# Altium schematic sheet Power.SchDoc: Power management
size A4; Author: Ph.A; SheetNumber: 6; SheetTotal: 8
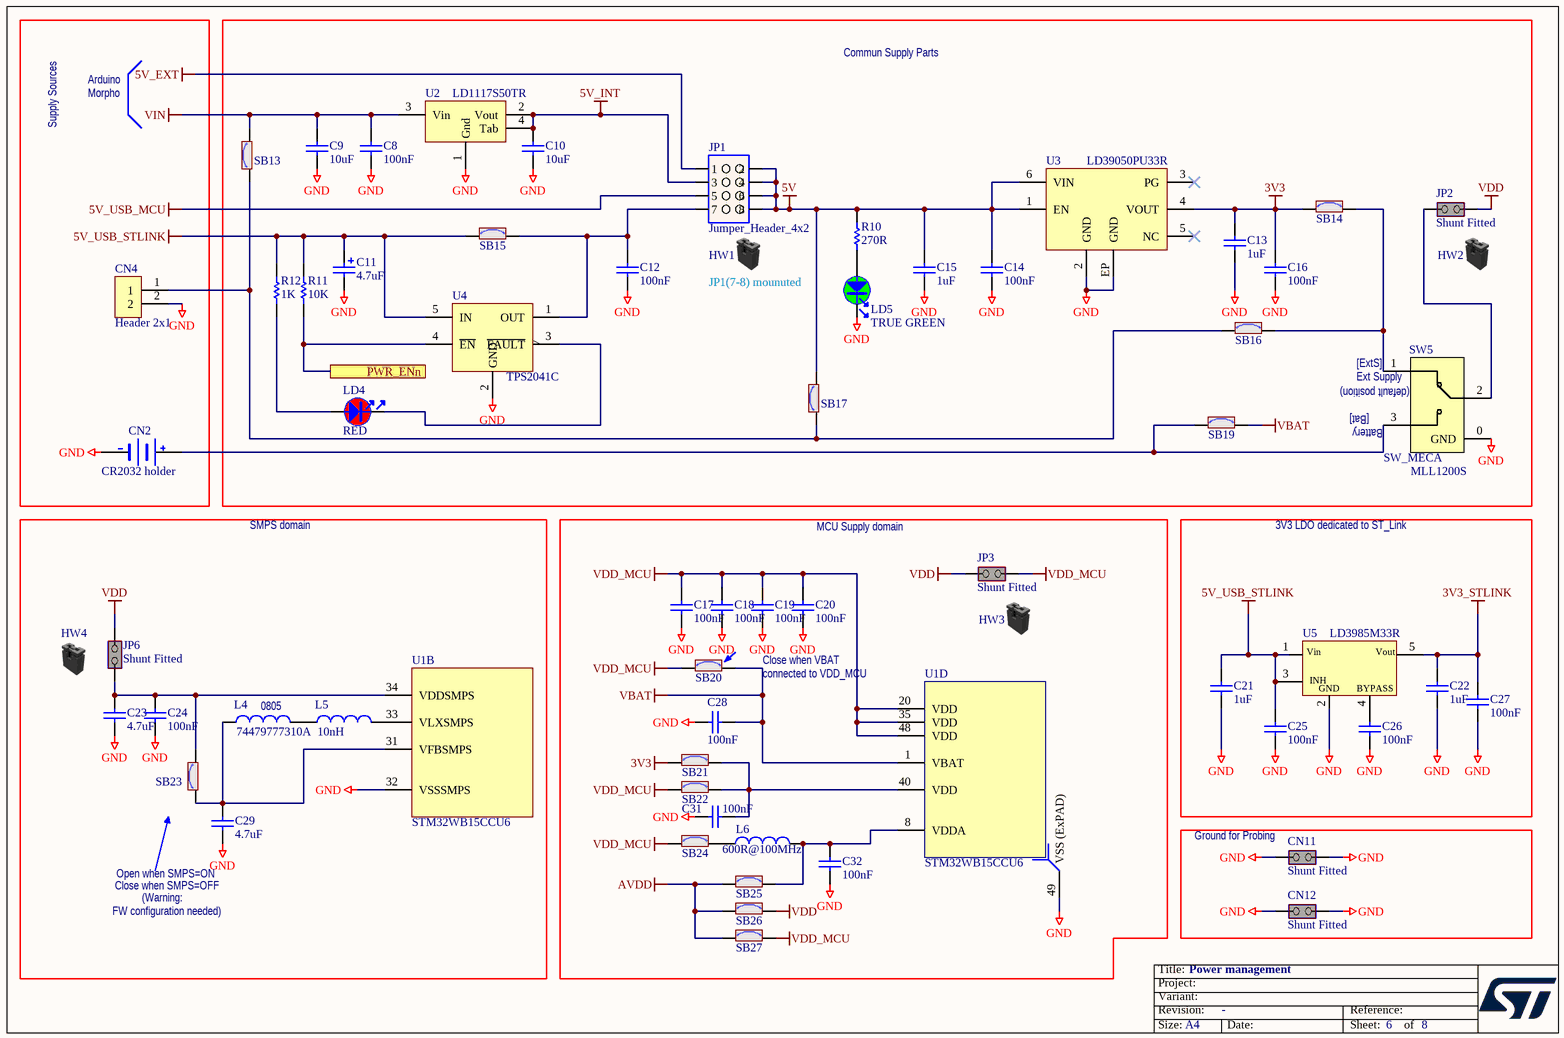
[diagram p0: Power.SchDoc]

## Parts
C8  value 100nF  [C0603]  (hidden comment: Capacitor)
C9  value 10uF  [C0805]  (hidden comment: Capacitor)
C10  value 10uF  [C0805]  (hidden comment: Capacitor)
C11  value 4.7uF  [CPOL_TAJ-A_1206_H180]  (hidden comment: Cap_POL_TANA)
C12  value 100nF  [C0402]  (hidden comment: Capacitor)
C13  value 1uF  [C0603]  (hidden comment: Capacitor)
C14  value 100nF  [C0402]  (hidden comment: Capacitor)
C15  value 1uF  [C0603]  (hidden comment: Capacitor)
C16  value 100nF  [C0402]  (hidden comment: Capacitor)
C17  value 100nF  [C0402]  (hidden comment: Capacitor)
C18  value 100nF  [C0402]  (hidden comment: Capacitor)
C19  value 100nF  [C0402]  (hidden comment: Capacitor)
C20  value 100nF  [C0402]  (hidden comment: Capacitor)
C21  value 1uF  [C0603]  (hidden comment: Capacitor)
C22  value 1uF  [C0603]  (hidden comment: Capacitor)
C23  value 4.7uF  [C0402]  (hidden comment: Capacitor)
C24  value 100nF  [C0402]  (hidden comment: Capacitor)
C25  value 100nF  [C0402]  (hidden comment: Capacitor)
C26  value 100nF  [C0402]  (hidden comment: Capacitor)
C27  value 100nF  [C0402]  (hidden comment: Capacitor)
C28  value 100nF  [C0402]  (hidden comment: Capacitor)
C29  value 4.7uF  [C0402]  (hidden comment: Capacitor)
C31  value 100nF  [C0402]  (hidden comment: Capacitor)
C32  value 100nF  [C0402]  (hidden comment: Capacitor)
CN2  value CR2032 holder  [BAT_RENATA-SMTU2032-LF_KEYSTONE-1769533_CR2032_SMD_2P_DI]  (hidden comment: BATTERY HOLDER)
CN4  Header 2x1  [CON_SAMTEC_TSW-102-07-G-S]
CN11  value Shunt Fitted  [CON_SAMTEC_TSW-102-07-G-S]  (hidden comment: Jumper_Header 2x1 Fitted)
CN12  value Shunt Fitted  [CON_SAMTEC_TSW-102-07-G-S]  (hidden comment: Jumper_Header 2x1 Fitted)
HW1  Shunt Black 2.54mm  (value not drawn)  (mechanical)
HW2  Shunt Black 2.54mm  (value not drawn)  (mechanical)
HW3  Shunt Black 2.54mm  (value not drawn)  (mechanical)
HW4  Shunt Black 2.54mm  (value not drawn)  (mechanical)
JP1  value Jumper_Header_4x2  [CON_SAMTEC_TSW-104-07-X-D]  (hidden comment: Jumper_Header 4x2)
JP2  value Shunt Fitted  [CON_SAMTEC_TSW-102-07-G-S]  (hidden comment: Jumper_Header 2x1 Fitted)
JP3  value Shunt Fitted  [CON_SAMTEC_TSW-102-07-G-S]  (hidden comment: Jumper_Header 2x1 Fitted)
JP6  value Shunt Fitted  [CON_SAMTEC_TSW-102-07-G-S]  (hidden comment: Jumper_Header 2x1 Fitted)
L4  value 74479777310A  [IND_0805_WURTH_74479777310A]  (hidden comment: Inductor)
L5  value 10nH  [IND_0402_MURATA_LQW15AN_H0P5]  (hidden comment: Inductor)
L6  value 600R@100MHz  [L0603]  (hidden comment: BEAD)
LD4  value RED  [LED_0603_VISHAY_VLMS1300-GS08_RED_1A2K_H0P8]  (hidden comment: LED_red)
LD5  value TRUE GREEN  [LED_0603_VISHAY_VLMTG1300-GS08_GREEN_1A2K_H0P8]  (hidden comment: LED_green)
R10  value 270R  [R0402]  (hidden comment: Resistor)
R11  value 10K  [R0402]  (hidden comment: Resistor)
R12  value 1K  [R0402]  (hidden comment: Resistor)
SB13  SB_ON  [SOLDER-BRIDGE_R0402-0R]  (value not drawn)
SB14  SB_ON  [SOLDER-BRIDGE_R0402-0R]  (value not drawn)
SB15  SB_ON  [SOLDER-BRIDGE_R0402-0R]  (value not drawn)
SB16  SB_ON  [SOLDER-BRIDGE_R0402-0R]  (value not drawn)
SB17  SB_ON  [SOLDER-BRIDGE_R0402-0R]  (value not drawn)
SB19  SB_ON  [SOLDER-BRIDGE_R0402-0R]  (value not drawn)
SB20  SB_ON  [SOLDER-BRIDGE_R0402-0R]  (value not drawn)
SB21  SB_ON  [SOLDER-BRIDGE_R0402-0R]  (value not drawn)
SB22  SB_ON  [SOLDER-BRIDGE_R0402-0R]  (value not drawn)
SB23  SB_ON  [SOLDER-BRIDGE_R0402-0R]  (value not drawn)
SB24  SB_ON  [SOLDER-BRIDGE_R0402-0R]  (value not drawn)
SB25  SB_ON  [SOLDER-BRIDGE_R0402-0R]  (value not drawn)
SB26  SB_ON  [SOLDER-BRIDGE_R0402-0R]  (value not drawn)
SB27  SB_ON  [SOLDER-BRIDGE_R0402-0R]  (value not drawn)
SW5  SW_MECA  value MLL1200S  [SWI_SPDT-RA_TE-CONNECTIVITY_MLL1200S_1P2T]
U1  value STM32WB15CCU6  [ICC_UFQFPN48-EPAD_7X7_H0P55_P050]  (hidden comment: STM32WB15_QFN48)  (parts B,D of 5)
U2  LD1117S50TR  [REG_SOT223-TAB]
U3  LD39050PU33R  [ICC_DFN6-EPAD_3X3_P095]
U4  TPS2041C  [MOS_SOT23-5L]
U5  LD3985M33R  [REG_SOT23-5L]

## Blocks framed on the sheet
3V3 LDO dedicated to ST_Link: C21 C22 C25-C27 U5
Ground for Probing: CN11 CN12

## Ports
PWR_ENn

## Nets
3V3: C13.2 C16.2 SB14.1 SB21.1 U3.4(VOUT)
3V3_STLINK: C22.2 C27.2 U5.5(Vout)
5V: C14.2 C15.2 JP1.2 JP1.4 JP1.6 JP1.8 R10.2 SB17.2 U3.1(EN) U3.6(VIN)
5V_EXT: JP1.1
5V_INT: C10.1 JP1.3 U2.2(Vout) U2.4(Tab)
5V_USB_MCU: JP1.5
5V_USB_STLINK: C11.1 C21.2 C25.2 R11.2 R12.2 SB15.1 U4.5(IN) U5.1(Vin) U5.3(CE)
AVDD: SB25.1 SB26.1 SB27.1
GND: C8.1 C9.2 C10.2 C11.2 C12.1 C13.1 C14.1 C15.1 C16.1 C17.1 C18.1 C19.1 C20.1 C21.1 C22.1 C23.1 C24.1 C25.1 C26.1 C27.1 C28.2 C29.1 C31.1 C32.1 CN2.2(-) CN4.2 CN11.1(COMMON) CN11.2(NO) CN12.1(COMMON) CN12.2(NO) LD5.2 SW5.0(GND) U1.32(VSSSMPS) U1.49(VSS_(ExPAD)) U2.1(Gnd) U3.2(GND) U3.EP(GND) U4.2(GND) U5.2(GND)
VBAT: C28.1 SB19.2 SB20.2 U1.1(VBAT)
VDD: JP2.2(NO) JP3.1(COMMON) JP6.1(COMMON) SB26.2
VDD_MCU: C17.2 C18.2 C19.2 C20.2 JP3.2(NO) SB20.1 SB22.1 SB24.1 SB27.2 U1.20(VDD) U1.35(VDD) U1.48(VDD)
VIN: C8.2 C9.1 SB13.2 U2.3(Vin)
PWR_ENn: R11.1 U4.4(~{EN}) ; port PWR_ENn
NetC12_2: C12.2 JP1.7 SB15.2 U4.1(OUT)
NetC23_2: C23.2 C24.2 JP6.2(NO) SB23.2 U1.34(VDDSMPS)
NetC26_2: C26.2 U5.4(BYPASS)
NetC29_2: C29.2 L4.1 SB23.1 U1.31(VFBSMPS)
NetC31_2: C31.2 SB21.2 SB22.2 U1.40(VDD)
NetC32_2: C32.2 L6.2 SB25.2 U1.8(VDDA)
NetCN2_1: CN2.1(+) SB19.1 SW5.3
NetCN4_1: CN4.1 SB13.1 SB16.1 SB17.1
NetJP2_1: JP2.1(COMMON) SW5.2
NetL4_2: L4.2 L5.1
NetL5_2: L5.2 U1.33(VLXSMPS)
NetL6_1: L6.1 SB24.2
NetLD4_1: LD4.1 R12.1
NetLD4_2: LD4.2 U4.3(~{FAULT})
NetLD5_1: LD5.1 R10.1
NetSB14_2: SB14.2 SB16.2 SW5.1

Not connected (* = marked no-connect by the designer): U3 3(PG)* 5(NC)*

## Notes on the sheet
- Arduino
- Morpho
- Commun Supply Parts
- Supply Sources
- JP1(7-8) mounuted
- (near SW5) Ext Supply
- (near SW5) [ExtS]
- (near SW5) (default position)
- (near SW5) [Bat]
- (near SW5) Battery
- SMPS domain
- MCU Supply domain
- (near L4) 0805
- Close when VBAT
- connected to VDD_MCU
- FW configuration needed)
- (near C29) Close when SMPS=OFF
- (near C29) Open when SMPS=ON
- (Warning:
- Title:
- Project:
- Size:
- Revision:
- Variant:
- A4
- -
- Date:
- Reference:
- Sheet:
- of
- (in symbol MCD-00086) INH

## Library data of the parts
C8 = MCD-01099: Capacitor, MLCC, 100nF, 50V, X7R, +/-10%, 0603, T=0.8mm; Manufacturer_Part_Number: CC0603KRX7R9BB104; Manufacturer: YAGEO; BMS_Part_Number: 9142278; Part_Preference: Recommended; Order_Code_RS: 669-8767; Internal_Part_Number: MCD-01099; Status: Released; Part_Type: Capacitor; Package: C0603; ComponentLink1URL: http://tunmcdsvn.tun.st.com/Component_Datasheet_Library/Trunk/Capacitors/Yageo_Multilayer_Capacitor_X7R_series_100pF_to_22uF/Yageo_Mutilayer_Capacitor_X7R_100pF_to_22uF.pdf; Order_Code_Digikey: 311-1344-1-ND; Order_Code_Farnell: 1362556
C9 C10 = MCD-00014: Capacitor, MLCC, 10uF, 25V, X5R, +/-10%, 0805, T=0,85mm; Manufacturer_Part_Number: CC0805KRX5R8BB106; Manufacturer: YAGEO; Part_Preference: Recommended; Internal_Part_Number: MCD-00014; Status: Released; Part_Type: Capacitor; Package: C0805; ComponentLink1URL: http://tunmcdsvn.tun.st.com/Component_Datasheet_Library/Trunk/Capacitors/Yageo_Multilayer_capacitor_X5R_series_100pF_to_100uF; Order_Code_Digikey: 311-3503-1-ND; Order_Code_Farnell: N/A; Order_Code_RS: N/A
C11 = MCD-00007: Capacitor, Tantalum, 4.7uF, 16V, 4ohms, +/-10%, pkg Type_A (3216 metric), T=1.6mm; Manufacturer_Part_Number: TAJA475K016R; Manufacturer: AVX; Part_Preference: Recommended; Order_Code_RS: 464-9132; Revision: July-2002: Re-released for DXP Platform.; Internal_Part_Number: MCD-00007; Status: Released; Part_Type: Capacitor; Package: Type_A; ComponentLink1URL: http://tunmcdsvn.tun.st.com/Component_Datasheet_Library/Trunk/Capacitors/AVX_Capacitor_TAJ-series; Order_Code_Digikey: 478-3868-1-ND; Order_Code_Farnell: 197269
C12 C14 C16-C20 C24-C28 C31 C32 = MCD-00006: Capacitor, MLCC, 100nF, 16V, X7R, +/-10%, 0402, T=0.5mm; Manufacturer_Part_Number: CC0402KRX7R7BB104; Manufacturer: YAGEO; Alternate_Manufacturer_Part_Number: GCM155R71C104KA55D; Alternate_Manufacturer: MURATA; Part_Preference: Recommended; Order_Code_RS: 616-9701; Internal_Part_Number: MCD-00006; Status: Released; Part_Type: Capacitor; Package: C0402; ComponentLink1URL: http://tunmcdsvn.tun.st.com/Component_Datasheet_Library/Trunk/Capacitors/Yageo_Multilayer_Capacitor_X7R_series_100pF_to_22uF; Order_Code_Digikey: 311-1338-1-ND; Order_Code_Farnell: 9402047
C13 C15 C21 C22 = MCD-00010: Capacitor, MLCC, 1uF, 16V, X5R, +/-10%, 0603, T=0,8mm; Manufacturer_Part_Number: CC0603KRX5R7BB105; Manufacturer: YAGEO; Part_Preference: Recommended; Internal_Part_Number: MCD-00010; Status: Released; Part_Type: Capacitor; Package: C0603; ComponentLink1URL: http://tunmcdsvn.tun.st.com/Component_Datasheet_Library/Trunk/Capacitors/Yageo_Multilayer_capacitor_X5R_series_100pF_to_100uF; Order_Code_Digikey: 311-1444-1-ND; Order_Code_Farnell: 2370680; Order_Code_RS: N/A
C23 C29 = MCD-01356: Capacitor, MLCC, 4.7uF, 6V3, X5R, +/-20%, 0402, T=0,5mm; Manufacturer_Part_Number: GRM155R60J475ME47; Manufacturer: MURATA; Alternate_Manufacturer_Part_Number: GRM155R60J475ME87; Part_Preference: Recommended; Order_Code_RS: 814-5230; Internal_Part_Number: MCD-01356; Status: Released; Part_Type: Capacitor; Package: C0402; ComponentLink1URL: http://tunmcdsvn.tun.st.com/Component_Datasheet_Library/Trunk/Capacitors/Murata_Capacitor_GR_series; Alternate_Manufacturer: MURATA; Order_Code_Digikey: 490-5915-1-ND; Order_Code_Farnell: 2666407
CN2 = MCD-02071: Battery Coin Cell holder, CR2032_20mm, Height 5.4mm; Part_Type: Connector; Manufacturer_Part_Number: SMTU2032-LF; Manufacturer: RENATA; Alternate_Manufacturer_Part_Number: KEYSTONE; Alternate_Manufacturer: 1060TR; Part_Preference: Recommended; Internal_Part_Number: MCD-02071; Status: Checked; ComponentLink1URL: http://tunmcdsvn.tun.st.com/Component_Datasheet_Library/Trunk/Connectors/Renata_SMTU2032-LF; Package: N/A; Order_Code_Digikey: N/A; Order_Code_Farnell: 1216354; Order_Code_RS: N/A
CN4 = MCD-00032: Header, 2x1, 2,54mm, VR, TH, Height 5.84mm/2.54mm; Manufacturer_Part_Number: TSW-102-07-G-S; Manufacturer: SAMTEC; Part_Type: Connector; Part_Preference: Recommended; Alternate_Manufacturer: JIUBABA; Alternate_Manufacturer_Part_Number: 313102S111116; Internal_Part_Number: MCD-00032; Value: Header 2x1; Status: Released; ComponentLink1URL: http://tunmcdsvn.tun.st.com/Component_Datasheet_Library/Trunk/Connectors/Samtec_TSW-HTSW-series
CN11 CN12 JP2 JP3 JP6 = MCD-00683: Header, 2x1, 2,54mm, VR, TH, Height 5.84mm/2.54mm - Shunt Fitted by default; Part_Type: Connector; Manufacturer_Part_Number: TSW-102-07-G-S; Manufacturer: SAMTEC; Alternate_Manufacturer_Part_Number: 313102S111116; Alternate_Manufacturer: LIANYI; Part_Preference: Recommended; Internal_Part_Number: MCD-00683; Status: Released; ComponentLink1URL: http://tunmcdsvn.tun.st.com/Component_Datasheet_Library/Trunk/Connectors/Samtec_TSW-HTSW-series
HW1-HW4 = MCD-00043: SHUNT 2.54mm BLACK; Manufacturer_Part_Number: SNT-100-BK-G; Manufacturer: SAMTEC; Part_Type: Misc; Part_Preference: Recommended; Alternate_Manufacturer: JIUBABA; Alternate_Manufacturer_Part_Number: 316102S111A; Value: SNT-100-BK-G; Internal_Part_Number: MCD-00043; Status: Released; ComponentLink1URL: http://tunmcdsvn.tun.st.com/Component_Datasheet_Library/Trunk/Connectors/Samtec_Shunt_Jumper_SNT100
JP1 = MCD-00633: Header, 4x2, 2,54mm, VR, TH, Height 5.84mm/2.54mm; Part_Type: Connector; Manufacturer_Part_Number: TSW-104-07-G-D; Manufacturer: SAMTEC; Part_Preference: Recommended; Internal_Part_Number: MCD-00633; Status: Released; ComponentLink1URL: http://tunmcdsvn.tun.st.com/Component_Datasheet_Library/Trunk/Connectors/Samtec_TSW-HTSW-series
L4 = MCD-01676: PMI Series 10 μH ±20% Multilayer SMD Inductor, 0805 25MHz 650mA dc 500mΩ Rdc; Manufacturer: WURTH ELEKTRONIK; Part_Preference: Recommended; Internal_Part_Number: MCD-01676; Status: Checked; Part_Type: Inductor; Manufacturer_Part_Number: 74479777310A; Package: 2x1.25x1.2 mm; ComponentLink1URL: http://tunmcdsvn.tun.st.com/Component_Datasheet_Library/Trunk/Inductors/Wurth_power_inductor_74404043010A/74479777310A.pdf; Alternate_Manufacturer: N/A; Alternate_Manufacturer_Part_Number: N/A; Order_Code_Digikey: N/A; Order_Code_Farnell: N/A; Order_Code_RS: N/A
L5 = MCD-02063: Inductor, 10nH +-2%, 100mA max,1.3 ohm DC max, Q min = 13,0402; Manufacturer_Part_Number: LQP15MN10NG02; Manufacturer: MURATA; Alternate_Manufacturer_Part_Number: 744901110; Alternate_Manufacturer: WURTH ELECTRONIK; Part_Preference: Forbidden; Order_Code_RS: 167-3827; Internal_Part_Number: MCD-02063; Status: NRND (Not Recommended for New Design); Part_Type: Inductor; Package: L0402; ComponentLink1URL: http://tunmcdsvn.tun.st.com/Component_Datasheet_Library/Trunk/Inductors/Murata_inductor_LQP15MN10NG02/Murata_inductor_LQP15MN10NG02.pdf; Order_Code_Digikey: 490-6743-1-ND; Order_Code_Farnell: 1762617
L6 = MCD-00047: SMD Chip ferrite bead, 600R@100MHz +/-25%, 350mA, 500mohm DC, 0603, T=0.8mm; Part_Type: Inductor; Manufacturer_Part_Number: FCM1608KF-601T03; Manufacturer: TAI-TECH; Part_Preference: Recommended; Internal_Part_Number: MCD-00047; Status: Released; ComponentLink1URL: http://tunmcdsvn.tun.st.com/Component_Datasheet_Library/Trunk/Inductors/TaiTech_Bead_FCM1608_series
LD4 = MCD-00587: LED Red, 0603 SMD, 2V Forward Voltage; Part_Type: Display; Manufacturer_Part_Number: VLMS1300-GS08; Manufacturer: VISHAY; Alternate_Manufacturer_Part_Number: LS Q976-NR-1; Alternate_Manufacturer: OSRAM OPTO SEMICONDUCTORS; Part_Preference: Recommended; Internal_Part_Number: MCD-00587; Status: Released; Package: LED 0603; ComponentLink1URL: http://tunmcdsvn.tun.st.com/Component_Datasheet_Library/Trunk/Display/VISHAY_LED_RED_VLMS1300-GS08; Order_Code_Digikey: VLMS1300-GS08CT-ND; Order_Code_Farnell: 2078728
LD5 = MCD-00589: LED Green, 0603 SMD, Fw Voltage = 2.8V - 3.6V; Part_Type: Display; Manufacturer_Part_Number: VLMTG1300-GS08; Manufacturer: VISHAY; Alternate_Manufacturer_Part_Number: LG Q396-PS-35; Alternate_Manufacturer: OSRAM OPTO SEMICONDUCTORS; Part_Preference: Recommended; Order_Code_RS: 7730452; Internal_Part_Number: MCD-00589; Status: Released; Package: LED 0603; ComponentLink1URL: http://tunmcdsvn.tun.st.com/Component_Datasheet_Library/Trunk/Display/VISHAY_LED_GREEN_VLMTG1300-GS08; Order_Code_Digikey: VLMTG1300-GS08CT-ND; Order_Code_Farnell: 2251490
R10 = MCD-00441: Resistor,270R,0402,1%,1/16W; Manufacturer_Part_Number: RC0402FR-07270RL; Manufacturer: YAGEO; Part_Preference: Recommended; Internal_Part_Number: MCD-00441; Status: Released; Part_Type: Resistor; Package: R0402; ComponentLink1URL: http://tunmcdsvn.tun.st.com/Component_Datasheet_Library/Trunk/Resistors/Yageo_Resistor_RC0402-series; Order_Code_Digikey: 311-270LRCT-ND; Order_Code_Farnell: 9239162; Order_Code_RS: N/A
R11 = MCD-00053: Resistor,10K,0402,1%,1/16W; Manufacturer_Part_Number: RC0402FR-0710KL; Manufacturer: YAGEO; BMS_Part_Number: 9131590; Part_Preference: Recommended; Internal_Part_Number: MCD-00053; Status: Released; Part_Type: Resistor; Package: R0402; ComponentLink1URL: http://tunmcdsvn.tun.st.com/Component_Datasheet_Library/Trunk/Resistors/Yageo_Resistor_RC0402-series; Order_Code_Digikey: 311-10.0KLRCT-ND; Order_Code_Farnell: 9239359; Order_Code_RS: N/A
R12 = MCD-00061: Resistor,1K,0402,1%,1/16W; Manufacturer_Part_Number: RC0402FR-071KL; Manufacturer: YAGEO; Part_Preference: Recommended; Internal_Part_Number: MCD-00061; Status: Released; Part_Type: Resistor; Package: R0402; ComponentLink1URL: http://tunmcdsvn.tun.st.com/Component_Datasheet_Library/Trunk/Resistors/Yageo_Resistor_RC0402-series; Order_Code_Digikey: 311-1.00KLRCT-ND; Order_Code_Farnell: 9239235; Order_Code_RS: N/A
SB13-SB17 SB19-SB27 = MCD-01618: Solder Bridge 0402 ON; Part_Type: Misc; Manufacturer_Part_Number: RC0402JR-070RL; Manufacturer: YAGEO; Part_Preference: Recommended; Order_Code_RS: 618-5804; Internal_Part_Number: MCD-01618; Status: Released; Package: SB0402; ComponentLink1URL: http://tunmcdsvn.tun.st.com/Component_Datasheet_Library/Trunk/Resistors/Yageo_Resistor_RC0402-series; Order_Code_Digikey: 311-0.0JRTR-ND; Order_Code_Farnell: 2363467
SW5 = MCD-02081: SPDT RA SMT SLIDE SWITCH; Part_Type: Connector; Manufacturer: TE CONNECTIVITY; Part_Preference: Recommended; Order_Code_RS: 2552311300; Internal_Part_Number: MCD-02081; Status: Checked; Manufacturer_Part_Number: MLL1200S; ComponentLink1URL: http://tunmcdsvn.tun.st.com/Component_Datasheet_Library/Trunk/Connectors/TE_Connectivity_MLL1200S/TE_MLL1200S.pdf; Alternate_Manufacturer: N/A; Alternate_Manufacturer_Part_Number: N/A; Package: N/A; Order_Code_Digikey: 450-1577-ND; Order_Code_Farnell: 2749889
U1 = MCD-02058: Multiprotocol wireless 32-bit MCU ARM®-based Cortex®-M4 with FPU, Bluetooth® Low-Energy and 802.15.4 radio solution; Part_Type: IC; Manufacturer: STMICROELECTRONICS; Part_Preference: Recommended; Manufacturer_HQ_COO: EU; Component_Country_Of_Origin: China; Internal_Part_Number: MCD-02058; Status: Standby; Manufacturer_Part_Number: STM32WB15CCU6; Package: UFQFPN48; ComponentLink1URL: http://tunmcdsvn.tun.st.com/Component_Datasheet_Library/Trunk/IC/STM_MCU_STM32WB15CCU6; Alternate_Manufacturer: N/A; Alternate_Manufacturer_Part_Number: N/A; Order_Code_Digikey: N/A; Order_Code_Farnell: N/A; Order_Code_RS: N/A
U2 = MCD-00088: IC REG LDO 5V 0.8A SOT223; Manufacturer: STMICROELECTRONICS; BMS_Part_Number: 9176133; Part_Preference: Recommended; Manufacturer_HQ_COO: EU; Internal_Part_Number: MCD-00088; Value: LD1117S50TR; Status: Released; Part_Type: IC; Manufacturer_Part_Number: LD1117S50TR; Package: SOT-223; ComponentLink1URL: http://tunmcdsvn.tun.st.com/Component_Datasheet_Library/Trunk/IC/STM_LDO_LD1117
U3 = MCD-00215: Low quiescent current and low noise voltage regulators; Part_Type: IC; Manufacturer: STMICROELECTRONICS; BMS_Part_Number: 9176126; Part_Preference: Recommended; Manufacturer_HQ_COO: EU; Internal_Part_Number: MCD-00215; Value: LD39050PU33R; Status: Released; Manufacturer_Part_Number: LD39050PU33R; Package: DFN6 3x3mm; ComponentLink1URL: http://tunmcdsvn.tun.st.com/Component_Datasheet_Library/Trunk/IC/STM_LDO_LD39050PU
U4 = MCD-01785: 5V Power Switch, 0.85A, RDSon 130mOhm max, with active low enable pin; Part_Type: IC; Manufacturer_Part_Number: TPS2041CDBVT; Manufacturer: TEXAS INSTRUMENTS; Part_Preference: Recommended; Internal_Part_Number: MCD-01785; Value: TPS2041C; Status: Released; Package: SOT23_5p; ComponentLink1URL: http://tunmcdsvn.tun.st.com/Component_Datasheet_Library/Trunk/IC/TI_PWR_SWITCH_5V_TPS20xxC
U5 = MCD-00086: Ultra low drop-low noise BiCMOS voltage, regulators low ESR capacitors compatible; Part_Type: IC; Manufacturer: STMICROELECTRONICS; BMS_Part_Number: 9176161; Part_Preference: Recommended; Manufacturer_HQ_COO: EU; Internal_Part_Number: MCD-00086; Value: LD3985M33R; Status: Released; Manufacturer_Part_Number: LD3985M33R; ComponentLink1URL: http://tunmcdsvn.tun.st.com/Component_Datasheet_Library/Trunk/IC/STM_LDO_LD3985